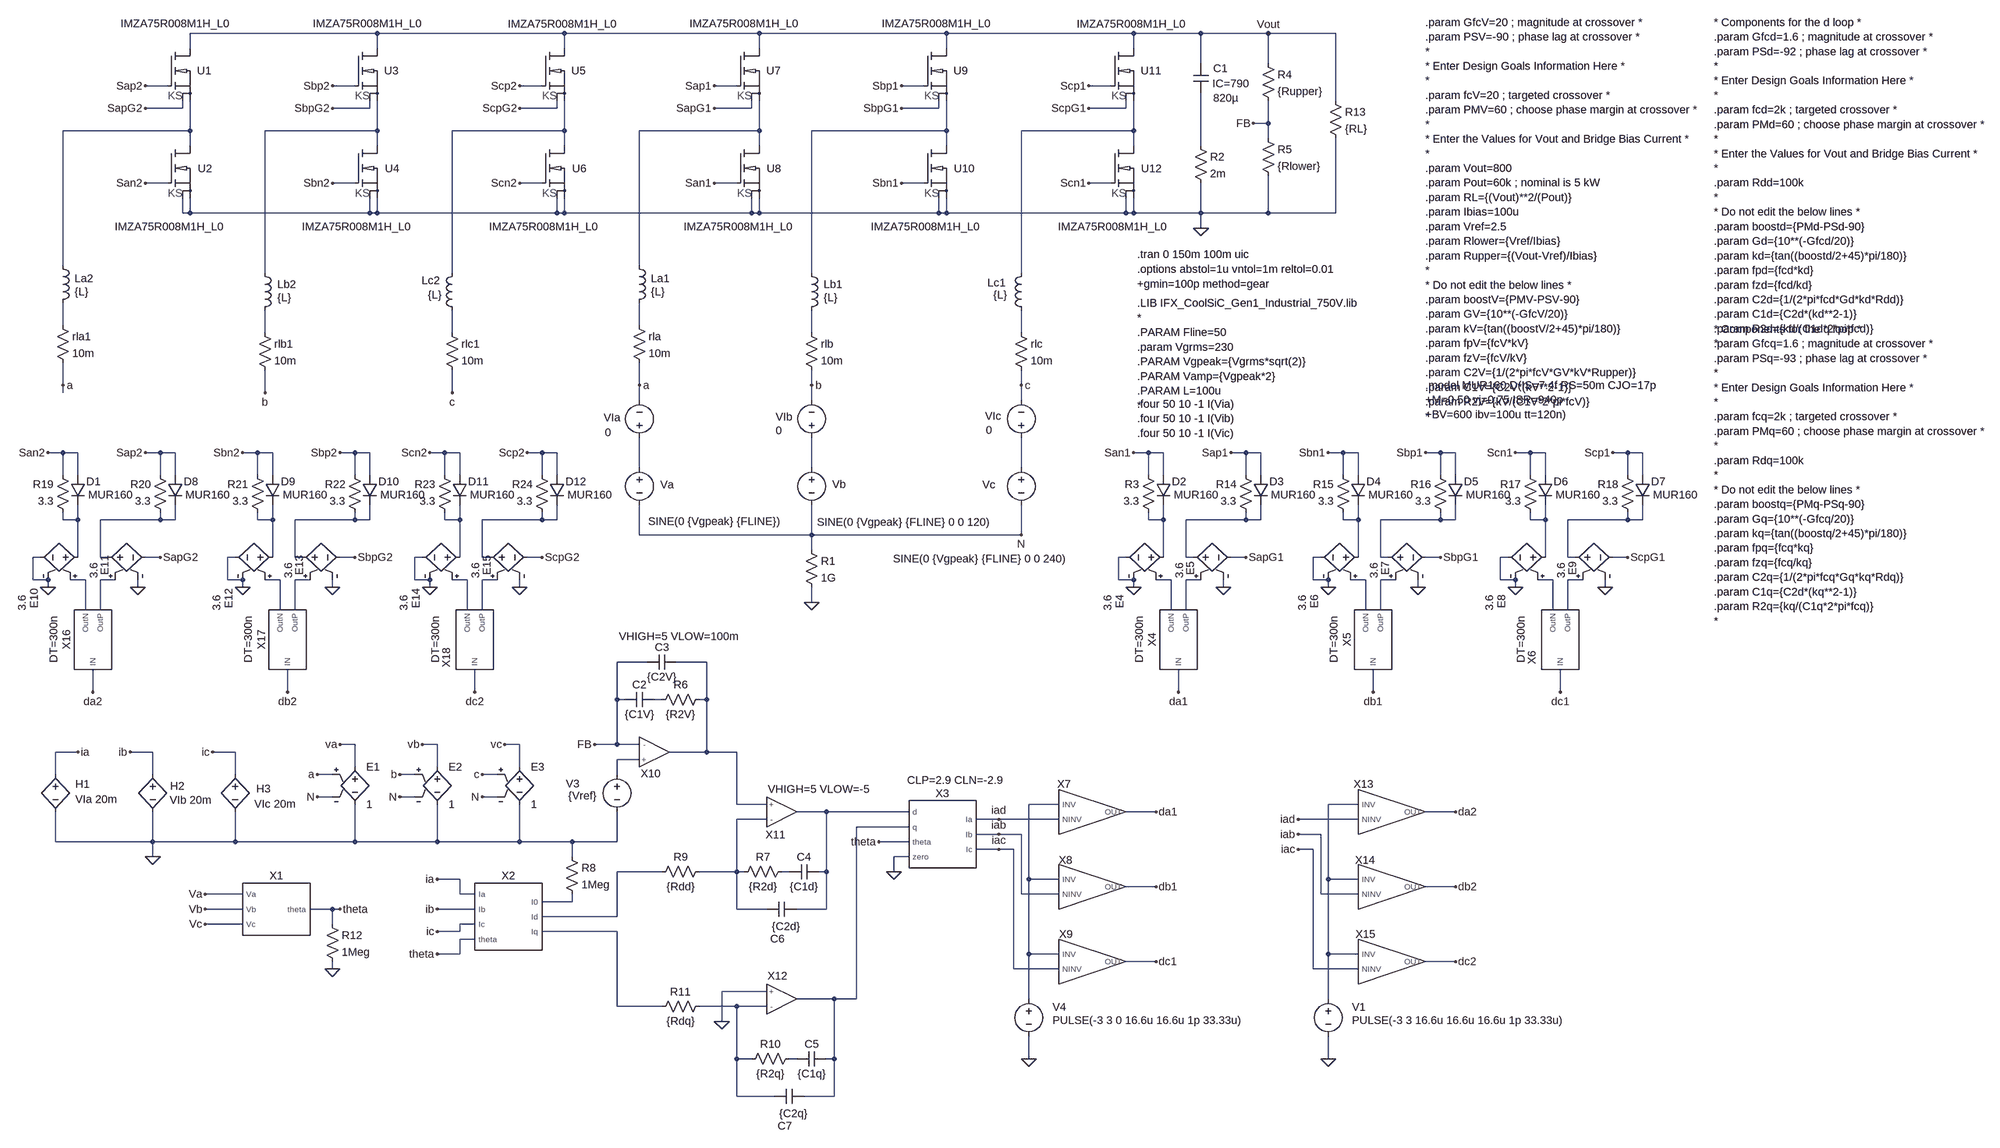
[diagram p0: schematic 3-phase PFC with SiC - interleaved.asc]
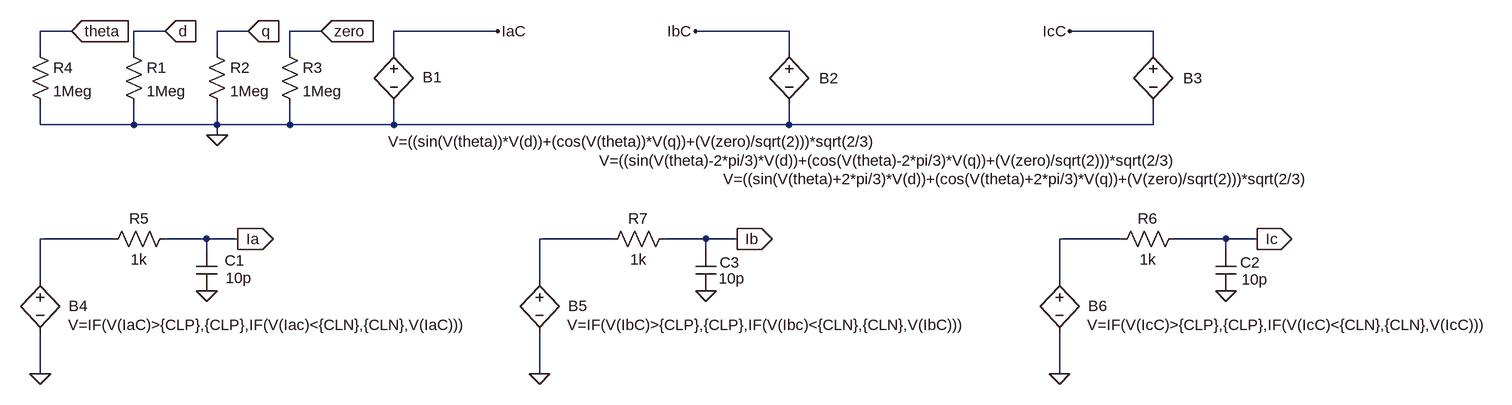
[diagram p1: sub-circuit inverse_dq0.asc]
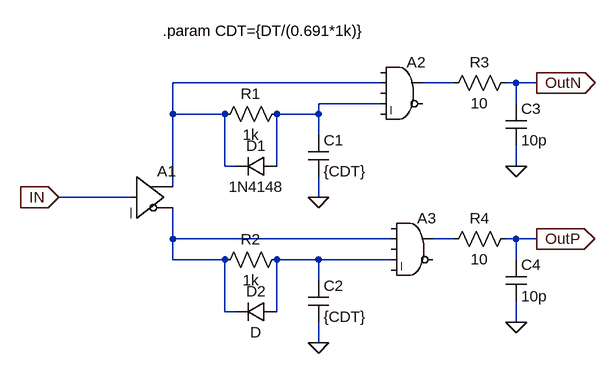
[diagram p2: sub-circuit dt_driver.asc]
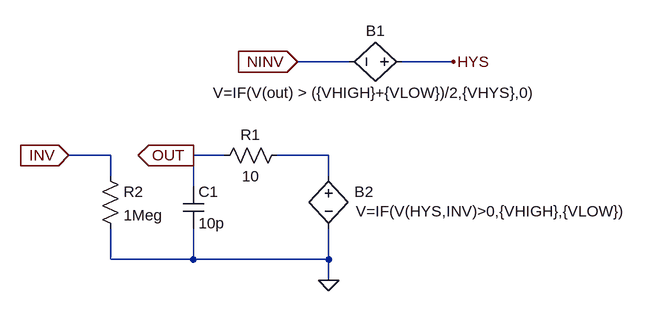
[diagram p3: sub-circuit comptof.asc]
3-phase PFC with SiC - interleaved.asc, the LTspice schematic file:
Version 4
SHEET 1 4316 1972
WIRE -528 -736 -928 -736
WIRE -128 -736 -528 -736
WIRE 288 -736 -128 -736
WIRE 688 -736 288 -736
WIRE 1088 -736 688 -736
WIRE 1232 -736 1088 -736
WIRE 1376 -736 1232 -736
WIRE 1520 -736 1376 -736
WIRE -928 -704 -928 -736
WIRE -528 -704 -528 -736
WIRE -128 -704 -128 -736
WIRE 288 -704 288 -736
WIRE 688 -704 688 -736
WIRE 1088 -704 1088 -736
WIRE 1232 -672 1232 -736
WIRE 1376 -672 1376 -736
WIRE -976 -624 -1024 -624
WIRE -576 -624 -624 -624
WIRE -176 -624 -224 -624
WIRE 240 -624 192 -624
WIRE 640 -624 592 -624
WIRE 1040 -624 992 -624
WIRE 1520 -592 1520 -736
WIRE -944 -576 -944 -592
WIRE -944 -576 -1024 -576
WIRE -544 -576 -544 -592
WIRE -544 -576 -624 -576
WIRE -144 -576 -144 -592
WIRE -144 -576 -224 -576
WIRE 272 -576 272 -592
WIRE 272 -576 192 -576
WIRE 672 -576 672 -592
WIRE 672 -576 592 -576
WIRE 1072 -576 1072 -592
WIRE 1072 -576 992 -576
WIRE 1376 -544 1376 -592
WIRE 1376 -544 1344 -544
WIRE -928 -528 -928 -592
WIRE -928 -528 -1200 -528
WIRE -528 -528 -528 -592
WIRE -528 -528 -768 -528
WIRE -128 -528 -128 -592
WIRE -128 -528 -368 -528
WIRE 288 -528 288 -592
WIRE 288 -528 32 -528
WIRE 688 -528 688 -592
WIRE 688 -528 400 -528
WIRE 1088 -528 1088 -592
WIRE 1088 -528 848 -528
WIRE 1376 -512 1376 -544
WIRE -928 -496 -928 -528
WIRE -528 -496 -528 -528
WIRE -128 -496 -128 -528
WIRE 288 -496 288 -528
WIRE 688 -496 688 -528
WIRE 1088 -496 1088 -528
WIRE 1232 -496 1232 -608
WIRE -976 -416 -1024 -416
WIRE -576 -416 -624 -416
WIRE -176 -416 -224 -416
WIRE 240 -416 192 -416
WIRE 640 -416 592 -416
WIRE 1040 -416 992 -416
WIRE -944 -352 -944 -384
WIRE -928 -352 -928 -384
WIRE -928 -352 -944 -352
WIRE -544 -352 -544 -384
WIRE -544 -352 -928 -352
WIRE -528 -352 -528 -384
WIRE -528 -352 -544 -352
WIRE -144 -352 -144 -384
WIRE -144 -352 -528 -352
WIRE -128 -352 -128 -384
WIRE -128 -352 -144 -352
WIRE 272 -352 272 -384
WIRE 272 -352 -128 -352
WIRE 288 -352 288 -384
WIRE 288 -352 272 -352
WIRE 672 -352 672 -384
WIRE 672 -352 288 -352
WIRE 688 -352 688 -384
WIRE 688 -352 672 -352
WIRE 1072 -352 1072 -384
WIRE 1072 -352 688 -352
WIRE 1088 -352 1088 -384
WIRE 1088 -352 1072 -352
WIRE 1232 -352 1232 -416
WIRE 1232 -352 1088 -352
WIRE 1376 -352 1376 -432
WIRE 1376 -352 1232 -352
WIRE 1520 -352 1520 -512
WIRE 1520 -352 1376 -352
WIRE 1232 -320 1232 -352
WIRE -1200 -240 -1200 -528
WIRE 32 -240 32 -528
WIRE -768 -224 -768 -528
WIRE -368 -224 -368 -528
WIRE 400 -224 400 -528
WIRE 848 -224 848 -528
WIRE -1200 -112 -1200 -160
WIRE 32 -112 32 -160
WIRE -768 -96 -768 -144
WIRE -368 -96 -368 -144
WIRE 400 -96 400 -144
WIRE 848 -96 848 -144
WIRE -1200 16 -1200 -32
WIRE 32 16 32 -32
WIRE 400 16 400 -16
WIRE 848 16 848 -16
WIRE -1200 32 -1200 16
WIRE -768 32 -768 -16
WIRE -368 32 -368 -16
WIRE 32 48 32 16
WIRE 400 48 400 16
WIRE 848 48 848 16
WIRE -1200 160 -1232 160
WIRE -1168 160 -1200 160
WIRE -992 160 -1024 160
WIRE -960 160 -992 160
WIRE -784 160 -816 160
WIRE -752 160 -784 160
WIRE -576 160 -608 160
WIRE -544 160 -576 160
WIRE -384 160 -416 160
WIRE -352 160 -384 160
WIRE -176 160 -208 160
WIRE -144 160 -176 160
WIRE 1120 160 1088 160
WIRE 1152 160 1120 160
WIRE 1328 160 1296 160
WIRE 1360 160 1328 160
WIRE 1536 160 1504 160
WIRE 1568 160 1536 160
WIRE 1744 160 1712 160
WIRE 1776 160 1744 160
WIRE 1936 160 1904 160
WIRE 1968 160 1936 160
WIRE 2144 160 2112 160
WIRE 2176 160 2144 160
WIRE 32 192 32 128
WIRE 400 192 400 128
WIRE 848 192 848 128
WIRE -1200 208 -1200 160
WIRE -1168 208 -1168 160
WIRE -992 208 -992 160
WIRE -960 208 -960 160
WIRE -784 208 -784 160
WIRE -752 208 -752 160
WIRE -576 208 -576 160
WIRE -544 208 -544 160
WIRE -384 208 -384 160
WIRE -352 208 -352 160
WIRE -176 208 -176 160
WIRE -144 208 -144 160
WIRE 1120 208 1120 160
WIRE 1152 208 1152 160
WIRE 1328 208 1328 160
WIRE 1360 208 1360 160
WIRE 1536 208 1536 160
WIRE 1568 208 1568 160
WIRE 1744 208 1744 160
WIRE 1776 208 1776 160
WIRE 1936 208 1936 160
WIRE 1968 208 1968 160
WIRE 2144 208 2144 160
WIRE 2176 208 2176 160
WIRE -1200 304 -1200 288
WIRE -1168 304 -1168 272
WIRE -1168 304 -1200 304
WIRE -992 304 -992 288
WIRE -992 304 -1120 304
WIRE -960 304 -960 272
WIRE -960 304 -992 304
WIRE -784 304 -784 288
WIRE -752 304 -752 272
WIRE -752 304 -784 304
WIRE -576 304 -576 288
WIRE -576 304 -704 304
WIRE -544 304 -544 272
WIRE -544 304 -576 304
WIRE -384 304 -384 288
WIRE -352 304 -352 272
WIRE -352 304 -384 304
WIRE -176 304 -176 288
WIRE -176 304 -304 304
WIRE -144 304 -144 272
WIRE -144 304 -176 304
WIRE 1120 304 1120 288
WIRE 1152 304 1152 272
WIRE 1152 304 1120 304
WIRE 1328 304 1328 288
WIRE 1328 304 1200 304
WIRE 1360 304 1360 272
WIRE 1360 304 1328 304
WIRE 1536 304 1536 288
WIRE 1568 304 1568 272
WIRE 1568 304 1536 304
WIRE 1744 304 1744 288
WIRE 1744 304 1616 304
WIRE 1776 304 1776 272
WIRE 1776 304 1744 304
WIRE 1936 304 1936 288
WIRE 1968 304 1968 272
WIRE 1968 304 1936 304
WIRE 2144 304 2144 288
WIRE 2144 304 2016 304
WIRE 2176 304 2176 272
WIRE 2176 304 2144 304
WIRE 32 336 32 272
WIRE 400 336 400 272
WIRE 400 336 32 336
WIRE 848 336 848 272
WIRE 848 336 400 336
WIRE 400 368 400 336
WIRE -1248 384 -1264 384
WIRE -1168 384 -1168 304
WIRE -1120 384 -1120 304
WIRE -1104 384 -1120 384
WIRE -992 384 -1024 384
WIRE -832 384 -848 384
WIRE -752 384 -752 304
WIRE -704 384 -704 304
WIRE -688 384 -704 384
WIRE -576 384 -608 384
WIRE -432 384 -448 384
WIRE -352 384 -352 304
WIRE -304 384 -304 304
WIRE -288 384 -304 384
WIRE -176 384 -208 384
WIRE 1072 384 1056 384
WIRE 1152 384 1152 304
WIRE 1200 384 1200 304
WIRE 1216 384 1200 384
WIRE 1328 384 1296 384
WIRE 1488 384 1472 384
WIRE 1568 384 1568 304
WIRE 1616 384 1616 304
WIRE 1632 384 1616 384
WIRE 1744 384 1712 384
WIRE 1888 384 1872 384
WIRE 1968 384 1968 304
WIRE 2016 384 2016 304
WIRE 2032 384 2016 384
WIRE 2144 384 2112 384
WIRE -1264 432 -1264 384
WIRE -1232 432 -1264 432
WIRE -1152 432 -1184 432
WIRE -1088 432 -1120 432
WIRE -848 432 -848 384
WIRE -816 432 -848 432
WIRE -736 432 -768 432
WIRE -672 432 -704 432
WIRE -448 432 -448 384
WIRE -416 432 -448 432
WIRE -336 432 -368 432
WIRE -272 432 -304 432
WIRE 1056 432 1056 384
WIRE 1088 432 1056 432
WIRE 1168 432 1136 432
WIRE 1232 432 1200 432
WIRE 1472 432 1472 384
WIRE 1504 432 1472 432
WIRE 1584 432 1552 432
WIRE 1648 432 1616 432
WIRE 1872 432 1872 384
WIRE 1904 432 1872 432
WIRE 1984 432 1952 432
WIRE 2048 432 2016 432
WIRE -1232 448 -1232 432
WIRE -1040 448 -1040 432
WIRE -816 448 -816 432
WIRE -624 448 -624 432
WIRE -416 448 -416 432
WIRE -224 448 -224 432
WIRE 1088 448 1088 432
WIRE 1280 448 1280 432
WIRE 1504 448 1504 432
WIRE 1696 448 1696 432
WIRE 1904 448 1904 432
WIRE 2096 448 2096 432
WIRE 400 480 400 448
WIRE -1152 496 -1152 432
WIRE -1120 496 -1120 432
WIRE -736 496 -736 432
WIRE -704 496 -704 432
WIRE -336 496 -336 432
WIRE -304 496 -304 432
WIRE 1168 496 1168 432
WIRE 1200 496 1200 432
WIRE 1584 496 1584 432
WIRE 1616 496 1616 432
WIRE 1984 496 1984 432
WIRE 2016 496 2016 432
WIRE 48 608 -16 608
WIRE 176 608 112 608
WIRE -1136 672 -1136 624
WIRE -720 672 -720 624
WIRE -320 672 -320 624
WIRE 1184 672 1184 624
WIRE 1600 672 1600 624
WIRE 2000 672 2000 624
WIRE -16 688 -16 608
WIRE 0 688 -16 688
WIRE 80 688 64 688
WIRE 176 688 176 608
WIRE 176 688 160 688
WIRE -576 784 -608 784
WIRE -400 784 -432 784
WIRE -224 784 -256 784
WIRE -16 784 -16 688
WIRE -16 784 -64 784
WIRE 32 784 -16 784
WIRE -1168 800 -1216 800
WIRE -1008 800 -1056 800
WIRE -832 800 -880 800
WIRE 176 800 176 688
WIRE 176 800 96 800
WIRE 240 800 176 800
WIRE 32 816 -16 816
WIRE -576 832 -576 784
WIRE -400 832 -400 784
WIRE -224 832 -224 784
WIRE -1216 848 -1216 800
WIRE -1008 848 -1008 800
WIRE -832 848 -832 800
WIRE -624 848 -656 848
WIRE -448 848 -480 848
WIRE -272 848 -304 848
WIRE -16 848 -16 816
WIRE -624 896 -656 896
WIRE -448 896 -480 896
WIRE -272 896 -304 896
WIRE 240 912 240 800
WIRE 304 912 240 912
WIRE 928 912 864 912
WIRE 1568 912 1504 912
WIRE 432 928 368 928
WIRE 608 928 432 928
WIRE 1136 928 1072 928
WIRE 1776 928 1712 928
WIRE 304 944 240 944
WIRE 800 944 752 944
WIRE 928 944 800 944
WIRE 1568 944 1440 944
WIRE 608 960 496 960
WIRE 800 976 752 976
WIRE 848 976 800 976
WIRE 1488 976 1440 976
WIRE -1216 992 -1216 928
WIRE -1008 992 -1008 928
WIRE -1008 992 -1216 992
WIRE -832 992 -832 928
WIRE -832 992 -1008 992
WIRE -576 992 -576 912
WIRE -576 992 -832 992
WIRE -400 992 -400 912
WIRE -400 992 -576 992
WIRE -224 992 -224 912
WIRE -224 992 -400 992
WIRE -112 992 -224 992
WIRE -16 992 -16 928
WIRE -16 992 -112 992
WIRE 608 992 544 992
WIRE 800 1008 752 1008
WIRE 832 1008 800 1008
WIRE 1472 1008 1440 1008
WIRE -1008 1024 -1008 992
WIRE -112 1024 -112 992
WIRE 608 1024 576 1024
WIRE 80 1056 -16 1056
WIRE 240 1056 240 944
WIRE 240 1056 160 1056
WIRE 256 1056 240 1056
WIRE 352 1056 336 1056
WIRE 432 1056 432 928
WIRE 432 1056 416 1056
WIRE 576 1056 576 1024
WIRE -352 1072 -400 1072
WIRE 864 1072 864 912
WIRE 928 1072 864 1072
WIRE 1504 1072 1504 912
WIRE 1568 1072 1504 1072
WIRE 1136 1088 1072 1088
WIRE 1776 1088 1712 1088
WIRE -816 1104 -896 1104
WIRE -352 1104 -352 1072
WIRE -320 1104 -352 1104
WIRE 848 1104 848 976
WIRE 928 1104 848 1104
WIRE 1488 1104 1488 976
WIRE 1568 1104 1488 1104
WIRE -112 1120 -112 1104
WIRE -112 1120 -176 1120
WIRE -816 1136 -896 1136
WIRE -624 1136 -672 1136
WIRE -608 1136 -624 1136
WIRE -320 1136 -400 1136
WIRE 240 1136 240 1056
WIRE 304 1136 240 1136
WIRE 432 1136 432 1056
WIRE 432 1136 368 1136
WIRE -16 1152 -16 1056
WIRE -16 1152 -176 1152
WIRE -816 1168 -896 1168
WIRE -624 1168 -624 1136
WIRE -320 1168 -352 1168
WIRE -352 1184 -352 1168
WIRE -352 1184 -400 1184
WIRE -16 1184 -176 1184
WIRE -320 1200 -352 1200
WIRE -352 1232 -352 1200
WIRE -352 1232 -400 1232
WIRE 864 1232 864 1072
WIRE 928 1232 864 1232
WIRE 1504 1232 1504 1072
WIRE 1568 1232 1504 1232
WIRE 1136 1248 1072 1248
WIRE 1776 1248 1712 1248
WIRE -624 1264 -624 1248
WIRE 832 1264 832 1008
WIRE 928 1264 832 1264
WIRE 1472 1264 1472 1008
WIRE 1568 1264 1472 1264
WIRE 304 1312 208 1312
WIRE 448 1328 368 1328
WIRE 496 1328 496 960
WIRE 496 1328 448 1328
WIRE 864 1328 864 1232
WIRE 1504 1328 1504 1232
WIRE -16 1344 -16 1184
WIRE 80 1344 -16 1344
WIRE 240 1344 160 1344
WIRE 304 1344 240 1344
WIRE 208 1376 208 1312
WIRE 240 1456 240 1344
WIRE 272 1456 240 1456
WIRE 368 1456 352 1456
WIRE 448 1456 448 1328
WIRE 448 1456 432 1456
WIRE 864 1456 864 1408
WIRE 1504 1456 1504 1408
WIRE 240 1536 240 1456
WIRE 320 1536 240 1536
WIRE 448 1536 448 1456
WIRE 448 1536 384 1536
FLAG 400 480 0
FLAG -1168 800 ia
FLAG -1056 800 ib
FLAG -880 800 ic
FLAG 32 16 a
FLAG 400 16 b
FLAG 848 16 c
FLAG -1008 1024 0
FLAG 192 -624 Sap1
FLAG 192 -416 San1
FLAG 1344 -544 FB
FLAG 1376 -736 Vout
FLAG -608 784 va
FLAG 848 336 N
FLAG -656 896 N
FLAG -656 848 a
FLAG -432 784 vb
FLAG -480 896 N
FLAG -480 848 b
FLAG -256 784 vc
FLAG -304 896 N
FLAG -304 848 c
FLAG -608 1136 theta
FLAG -896 1104 Va
FLAG -896 1136 Vb
FLAG -896 1168 Vc
FLAG -400 1072 ia
FLAG -400 1136 ib
FLAG -400 1184 ic
FLAG -400 1232 theta
FLAG -64 784 FB
FLAG 208 1376 0
FLAG 544 992 theta
FLAG 576 1056 0
FLAG 864 1456 0
FLAG 1136 928 da1
FLAG 1136 1088 db1
FLAG 1136 1248 dc1
FLAG 1184 672 da1
FLAG 1088 160 San1
FLAG 1296 160 Sap1
FLAG 1600 672 db1
FLAG 2000 672 dc1
FLAG -624 1264 0
FLAG 1088 448 0
FLAG 1280 448 0
FLAG 1328 384 SapG1
FLAG 1232 -320 0
FLAG 1504 160 Sbn1
FLAG 1712 160 Sbp1
FLAG 1504 448 0
FLAG 1696 448 0
FLAG 1744 384 SbpG1
FLAG 1904 160 Scn1
FLAG 2112 160 Scp1
FLAG 1904 448 0
FLAG 2096 448 0
FLAG 2144 384 ScpG1
FLAG 192 -576 SapG1
FLAG 592 -624 Sbp1
FLAG 592 -416 Sbn1
FLAG 592 -576 SbpG1
FLAG 992 -624 Scp1
FLAG 992 -416 Scn1
FLAG 992 -576 ScpG1
FLAG 800 944 iad
FLAG 800 976 iab
FLAG 800 1008 iac
FLAG 1504 1456 0
FLAG 1776 928 da2
FLAG 1776 1088 db2
FLAG 1776 1248 dc2
FLAG 1440 944 iad
FLAG 1440 976 iab
FLAG 1440 1008 iac
FLAG -1024 -624 Sap2
FLAG -1024 -416 San2
FLAG -1024 -576 SapG2
FLAG -624 -624 Sbp2
FLAG -624 -416 Sbn2
FLAG -624 -576 SbpG2
FLAG -224 -624 Scp2
FLAG -224 -416 Scn2
FLAG -224 -576 ScpG2
FLAG -1200 16 a
FLAG -768 32 b
FLAG -368 32 c
FLAG -1136 672 da2
FLAG -1232 160 San2
FLAG -1024 160 Sap2
FLAG -720 672 db2
FLAG -320 672 dc2
FLAG -1232 448 0
FLAG -1040 448 0
FLAG -992 384 SapG2
FLAG -816 160 Sbn2
FLAG -608 160 Sbp2
FLAG -816 448 0
FLAG -624 448 0
FLAG -576 384 SbpG2
FLAG -416 160 Scn2
FLAG -208 160 Scp2
FLAG -416 448 0
FLAG -224 448 0
FLAG -176 384 ScpG2
SYMBOL voltage 32 176 R0
WINDOW 0 45 53 Left 2
WINDOW 3 19 131 Left 2
WINDOW 123 0 0 Left 0
WINDOW 39 0 0 Left 0
SYMATTR InstName Va
SYMATTR Value SINE(0 {Vgpeak} {FLINE})
SYMBOL voltage 400 176 R0
WINDOW 0 44 52 Left 2
WINDOW 3 12 133 Left 2
WINDOW 123 0 0 Left 0
WINDOW 39 0 0 Left 0
SYMATTR InstName Vb
SYMATTR Value SINE(0 {Vgpeak} {FLINE} 0 0 120)
SYMBOL voltage 848 176 R0
WINDOW 0 -83 53 Left 2
WINDOW 3 -274 211 Left 2
WINDOW 123 0 0 Left 0
WINDOW 39 0 0 Left 0
SYMATTR InstName Vc
SYMATTR Value SINE(0 {Vgpeak} {FLINE} 0 0 240)
SYMBOL res 384 352 R0
SYMATTR InstName R1
SYMATTR Value 1G
SYMBOL res 16 -128 R0
SYMATTR InstName rla
SYMATTR Value 10m
SYMBOL res 384 -112 R0
SYMATTR InstName rlb
SYMATTR Value 10m
SYMBOL res 832 -112 R0
SYMATTR InstName rlc
SYMATTR Value 10m
SYMBOL h -1216 832 R0
WINDOW 0 43 37 Left 2
WINDOW 3 43 69 Left 2
SYMATTR InstName H1
SYMATTR Value VIa 20m
SYMBOL h -1008 832 R0
WINDOW 0 37 41 Left 2
WINDOW 3 36 71 Left 2
SYMATTR InstName H2
SYMATTR Value VIb 20m
SYMBOL h -832 832 R0
WINDOW 0 45 47 Left 2
WINDOW 3 41 79 Left 2
SYMATTR InstName H3
SYMATTR Value VIc 20m
SYMBOL ind 16 -256 R0
WINDOW 0 41 44 Left 2
WINDOW 3 41 72 Left 2
SYMATTR InstName La1
SYMATTR Value {L}
SYMBOL ind 384 -240 R0
WINDOW 0 42 40 Left 2
WINDOW 3 42 69 Left 2
SYMATTR InstName Lb1
SYMATTR Value {L}
SYMBOL ind 864 -128 R180
WINDOW 0 49 75 Left 2
WINDOW 3 46 49 Left 2
SYMATTR InstName Lc1
SYMATTR Value {L}
SYMBOL voltage 32 144 R180
WINDOW 0 40 59 Left 2
WINDOW 3 60 27 Left 2
WINDOW 123 0 0 Left 0
WINDOW 39 0 0 Left 0
SYMATTR InstName VIa
SYMATTR Value 0
SYMBOL voltage 400 144 R180
WINDOW 0 41 60 Left 2
WINDOW 3 63 31 Left 2
WINDOW 123 0 0 Left 0
WINDOW 39 0 0 Left 0
SYMATTR InstName VIb
SYMATTR Value 0
SYMBOL voltage 848 144 R180
WINDOW 0 43 62 Left 2
WINDOW 3 62 32 Left 2
WINDOW 123 0 0 Left 0
WINDOW 39 0 0 Left 0
SYMATTR InstName VIc
SYMATTR Value 0
SYMBOL cap 1216 -672 R0
WINDOW 0 42 11 Left 2
WINDOW 3 42 74 Left 2
WINDOW 123 41 43 Left 2
SYMATTR InstName C1
SYMATTR Value 820µ
SYMATTR Value2 IC=790
SYMBOL res 1216 -512 R0
SYMATTR InstName R2
SYMATTR Value 2m
SYMBOL res 1360 -688 R0
SYMATTR InstName R4
SYMATTR Value {Rupper}
SYMBOL res 1360 -528 R0
SYMATTR InstName R5
SYMATTR Value {Rlower}
SYMBOL e -576 816 R0
SYMATTR InstName E1
SYMATTR Value 1
SYMBOL e -400 816 R0
SYMATTR InstName E2
SYMATTR Value 1
SYMBOL e -224 816 R0
SYMATTR InstName E3
SYMATTR Value 1
SYMBOL theta_sub -752 1136 R0
SYMATTR InstName X1
SYMBOL dq0_sub -256 1152 R0
SYMATTR InstName X2
SYMBOL res 176 672 R90
WINDOW 0 0 56 VBottom 2
WINDOW 3 32 56 VTop 2
SYMATTR InstName R6
SYMATTR Value {R2V}
SYMBOL cap 64 672 R90
WINDOW 0 0 32 VBottom 2
WINDOW 3 32 32 VTop 2
SYMATTR InstName C2
SYMATTR Value {C1V}
SYMBOL cap 112 592 R90
WINDOW 0 0 32 VBottom 2
WINDOW 3 32 32 VTop 2
SYMATTR InstName C3
SYMATTR Value {C2V}
SYMBOL voltage -16 832 M0
WINDOW 0 80 36 Left 2
WINDOW 3 43 62 Left 2
SYMATTR InstName V3
SYMATTR Value {Vref}
SYMBOL res 240 1072 R270
WINDOW 0 32 56 VTop 2
WINDOW 3 0 56 VBottom 2
SYMATTR InstName R7
SYMATTR Value {R2d}
SYMBOL cap 352 1072 R270
WINDOW 0 32 32 VTop 2
WINDOW 3 0 32 VBottom 2
SYMATTR InstName C4
SYMATTR Value {C1d}
SYMBOL cap 304 1152 R270
WINDOW 0 -63 23 VTop 2
WINDOW 3 -5 41 VBottom 2
SYMATTR InstName C6
SYMATTR Value {C2d}
SYMBOL res -128 1008 R0
SYMATTR InstName R8
SYMATTR Value 1Meg
SYMBOL res 176 1040 R90
WINDOW 0 0 56 VBottom 2
WINDOW 3 32 56 VTop 2
SYMATTR InstName R9
SYMATTR Value {Rdd}
SYMBOL res 256 1472 R270
WINDOW 0 32 56 VTop 2
WINDOW 3 0 56 VBottom 2
SYMATTR InstName R10
SYMATTR Value {R2q}
SYMBOL cap 368 1472 R270
WINDOW 0 32 32 VTop 2
WINDOW 3 0 32 VBottom 2
SYMATTR InstName C5
SYMATTR Value {C1q}
SYMBOL cap 320 1552 R270
WINDOW 0 -63 23 VTop 2
WINDOW 3 -5 41 VBottom 2
SYMATTR InstName C7
SYMATTR Value {C2q}
SYMBOL res 176 1328 R90
WINDOW 0 0 56 VBottom 2
WINDOW 3 32 56 VTop 2
SYMATTR InstName R11
SYMATTR Value {Rdq}
SYMBOL Inverse_dq0 672 976 R0
WINDOW 39 35 -100 Bottom 2
SYMATTR SpiceLine CLP=2.9 CLN=-2.9
SYMATTR InstName X3
SYMBOL voltage 864 1312 R0
WINDOW 123 0 0 Left 0
WINDOW 39 0 0 Left 0
WINDOW 0 51 33 Left 2
WINDOW 3 51 62 Left 2
SYMATTR InstName V4
SYMATTR Value PULSE(-3 3 0 16.6u 16.6u 1p 33.33u)
SYMBOL DT_driver 1184 560 R270
WINDOW 39 0 -68 Bottom 2
SYMATTR SpiceLine DT=300n
SYMATTR InstName X4
SYMBOL DT_driver 1600 560 R270
WINDOW 39 0 -68 Bottom 2
SYMATTR SpiceLine DT=300n
SYMATTR InstName X5
SYMBOL DT_driver 2000 560 R270
WINDOW 39 0 -68 Bottom 2
WINDOW 0 -38 -45 Bottom 2
SYMATTR SpiceLine DT=300n
SYMATTR InstName X6
SYMBOL res -640 1152 R0
SYMATTR InstName R12
SYMATTR Value 1Meg
SYMBOL COMPTOF 992 928 R0
WINDOW 0 -52 -44 Bottom 2
SYMATTR InstName X7
SYMATTR SpiceLine VHIGH=5 VLOW=100m VHYS=10m
SYMBOL COMPTOF 992 1088 R0
WINDOW 0 -49 -41 Bottom 2
SYMATTR InstName X8
SYMATTR SpiceLine VHIGH=5 VLOW=100m VHYS=10m
SYMBOL COMPTOF 992 1248 R0
WINDOW 0 -48 -43 Bottom 2
SYMATTR InstName X9
SYMATTR SpiceLine VHIGH=5 VLOW=100m VHYS=10m
SYMBOL opampTOF 96 784 R0
WINDOW 0 -40 78 Bottom 2
WINDOW 39 20 -216 Bottom 2
SYMATTR InstName X10
SYMATTR SpiceLine VHIGH=5 VLOW=100m
SYMBOL opampTOF 368 944 M180
WINDOW 0 -45 -17 Bottom 2
WINDOW 39 47 80 Bottom 2
SYMATTR InstName X11
SYMATTR SpiceLine VHIGH=5 VLOW=-5
SYMBOL opampTOF 368 1344 M180
WINDOW 0 -41 81 Bottom 2
SYMATTR InstName X12
SYMATTR SpiceLine VHIGH=5 VLOW=-5
SYMBOL res 1504 -608 R0
SYMATTR InstName R13
SYMATTR Value {RL}
SYMBOL e 1168 384 M270
WINDOW 0 -109 109 Left 2
WINDOW 3 -114 135 Left 2
SYMATTR InstName E4
SYMATTR Value 3.6
SYMBOL e 1200 384 R270
WINDOW 0 -38 10 Left 2
WINDOW 3 -45 -14 Left 2
SYMATTR InstName E5
SYMATTR Value 3.6
SYMBOL res 1136 304 R180
WINDOW 0 36 76 Left 2
WINDOW 3 36 40 Left 2
SYMATTR InstName R3
SYMATTR Value 3.3
SYMBOL res 1344 304 R180
WINDOW 0 36 76 Left 2
WINDOW 3 36 40 Left 2
SYMATTR InstName R14
SYMATTR Value 3.3
SYMBOL e 1584 384 M270
WINDOW 0 -109 109 Left 2
WINDOW 3 -114 135 Left 2
SYMATTR InstName E6
SYMATTR Value 3.6
SYMBOL e 1616 384 R270
WINDOW 0 -38 10 Left 2
WINDOW 3 -45 -14 Left 2
SYMATTR InstName E7
SYMATTR Value 3.6
SYMBOL res 1552 304 R180
WINDOW 0 36 76 Left 2
WINDOW 3 36 40 Left 2
SYMATTR InstName R15
SYMATTR Value 3.3
SYMBOL res 1760 304 R180
WINDOW 0 36 76 Left 2
WINDOW 3 36 40 Left 2
SYMATTR InstName R16
SYMATTR Value 3.3
SYMBOL e 1984 384 M270
WINDOW 0 -109 109 Left 2
WINDOW 3 -114 135 Left 2
SYMATTR InstName E8
SYMATTR Value 3.6
SYMBOL e 2016 384 R270
WINDOW 0 -38 10 Left 2
WINDOW 3 -45 -14 Left 2
SYMATTR InstName E9
SYMATTR Value 3.6
SYMBOL res 1952 304 R180
WINDOW 0 36 76 Left 2
WINDOW 3 36 40 Left 2
SYMATTR InstName R17
SYMATTR Value 3.3
SYMBOL res 2160 304 R180
WINDOW 0 36 76 Left 2
WINDOW 3 36 40 Left 2
SYMATTR InstName R18
SYMATTR Value 3.3
SYMBOL TO247_4L 240 -704 R0
WINDOW 3 -101 -53 Left 2
WINDOW 0 63 48 Left 2
SYMATTR Value IMZA75R008M1H_L0
SYMATTR InstName U7
SYMBOL TO247_4L 240 -496 R0
WINDOW 3 -113 173 Left 2
WINDOW 0 64 49 Left 2
SYMATTR Value IMZA75R008M1H_L0
SYMATTR InstName U8
SYMBOL TO247_4L 640 -704 R0
WINDOW 3 -90 -53 Left 2
WINDOW 0 63 48 Left 2
SYMATTR Value IMZA75R008M1H_L0
SYMATTR InstName U9
SYMBOL TO247_4L 640 -496 R0
WINDOW 3 -113 173 Left 2
WINDOW 0 64 49 Left 2
SYMATTR Value IMZA75R008M1H_L0
SYMATTR InstName U10
SYMBOL TO247_4L 1040 -704 R0
WINDOW 3 -73 -52 Left 2
WINDOW 0 63 48 Left 2
SYMATTR Value IMZA75R008M1H_L0
SYMATTR InstName U11
SYMBOL TO247_4L 1040 -496 R0
WINDOW 3 -113 173 Left 2
WINDOW 0 64 49 Left 2
SYMATTR Value IMZA75R008M1H_L0
SYMATTR InstName U12
SYMBOL diode 1136 208 R0
WINDOW 0 34 14 Left 2
WINDOW 3 38 42 Left 2
SYMATTR InstName D2
SYMATTR Value MUR160
SYMBOL diode 1344 208 R0
WINDOW 0 34 14 Left 2
WINDOW 3 38 42 Left 2
SYMATTR InstName D3
SYMATTR Value MUR160
SYMBOL diode 1552 208 R0
WINDOW 0 34 14 Left 2
WINDOW 3 38 42 Left 2
SYMATTR InstName D4
SYMATTR Value MUR160
SYMBOL diode 1760 208 R0
WINDOW 0 34 14 Left 2
WINDOW 3 38 42 Left 2
SYMATTR InstName D5
SYMATTR Value MUR160
SYMBOL diode 1952 208 R0
WINDOW 0 34 14 Left 2
WINDOW 3 38 42 Left 2
SYMATTR InstName D6
SYMATTR Value MUR160
SYMBOL diode 2160 208 R0
WINDOW 0 34 14 Left 2
WINDOW 3 38 42 Left 2
SYMATTR InstName D7
SYMATTR Value MUR160
SYMBOL voltage 1504 1312 R0
WINDOW 123 0 0 Left 0
WINDOW 39 0 0 Left 0
WINDOW 0 51 33 Left 2
WINDOW 3 51 62 Left 2
SYMATTR InstName V1
SYMATTR Value PULSE(-3 3 16.6u 16.6u 16.6u 1p 33.33u)
SYMBOL COMPTOF 1632 928 R0
WINDOW 0 -52 -44 Bottom 2
SYMATTR InstName X13
SYMATTR SpiceLine VHIGH=5 VLOW=100m VHYS=10m
SYMBOL COMPTOF 1632 1088 R0
WINDOW 0 -49 -41 Bottom 2
SYMATTR InstName X14
SYMATTR SpiceLine VHIGH=5 VLOW=100m VHYS=10m
SYMBOL COMPTOF 1632 1248 R0
WINDOW 0 -48 -43 Bottom 2
SYMATTR InstName X15
SYMATTR SpiceLine VHIGH=5 VLOW=100m VHYS=10m
SYMBOL TO247_4L -976 -704 R0
WINDOW 3 -101 -53 Left 2
WINDOW 0 63 48 Left 2
SYMATTR Value IMZA75R008M1H_L0
SYMATTR InstName U1
SYMBOL TO247_4L -976 -496 R0
WINDOW 3 -113 173 Left 2
WINDOW 0 64 49 Left 2
SYMATTR Value IMZA75R008M1H_L0
SYMATTR InstName U2
SYMBOL TO247_4L -576 -704 R0
WINDOW 3 -90 -53 Left 2
WINDOW 0 63 48 Left 2
SYMATTR Value IMZA75R008M1H_L0
SYMATTR InstName U3
SYMBOL TO247_4L -576 -496 R0
WINDOW 3 -113 173 Left 2
WINDOW 0 64 49 Left 2
SYMATTR Value IMZA75R008M1H_L0
SYMATTR InstName U4
SYMBOL TO247_4L -176 -704 R0
WINDOW 3 -73 -52 Left 2
WINDOW 0 63 48 Left 2
SYMATTR Value IMZA75R008M1H_L0
SYMATTR InstName U5
SYMBOL TO247_4L -176 -496 R0
WINDOW 3 -113 173 Left 2
WINDOW 0 64 49 Left 2
SYMATTR Value IMZA75R008M1H_L0
SYMATTR InstName U6
SYMBOL res -1216 -128 R0
SYMATTR InstName rla1
SYMATTR Value 10m
SYMBOL res -784 -112 R0
SYMATTR InstName rlb1
SYMATTR Value 10m
SYMBOL res -384 -112 R0
SYMATTR InstName rlc1
SYMATTR Value 10m
SYMBOL ind -1216 -256 R0
WINDOW 0 41 44 Left 2
WINDOW 3 41 72 Left 2
SYMATTR InstName La2
SYMATTR Value {L}
SYMBOL ind -784 -240 R0
WINDOW 0 42 40 Left 2
WINDOW 3 42 69 Left 2
SYMATTR InstName Lb2
SYMATTR Value {L}
SYMBOL ind -352 -128 R180
WINDOW 0 42 80 Left 2
WINDOW 3 38 49 Left 2
SYMATTR InstName Lc2
SYMATTR Value {L}
SYMBOL DT_driver -1136 560 R270
WINDOW 39 0 -68 Bottom 2
SYMATTR SpiceLine DT=300n
SYMATTR InstName X16
SYMBOL DT_driver -720 560 R270
WINDOW 39 0 -68 Bottom 2
SYMATTR SpiceLine DT=300n
SYMATTR InstName X17
SYMBOL DT_driver -320 560 R270
WINDOW 39 0 -68 Bottom 2
WINDOW 0 -38 -45 Bottom 2
SYMATTR SpiceLine DT=300n
SYMATTR InstName X18
SYMBOL e -1152 384 M270
WINDOW 0 -109 109 Left 2
WINDOW 3 -114 135 Left 2
SYMATTR InstName E10
SYMATTR Value 3.6
SYMBOL e -1120 384 R270
WINDOW 0 -38 10 Left 2
WINDOW 3 -45 -14 Left 2
SYMATTR InstName E11
SYMATTR Value 3.6
SYMBOL res -1184 304 R180
WINDOW 0 36 76 Left 2
WINDOW 3 36 40 Left 2
SYMATTR InstName R19
SYMATTR Value 3.3
SYMBOL res -976 304 R180
WINDOW 0 36 76 Left 2
WINDOW 3 36 40 Left 2
SYMATTR InstName R20
SYMATTR Value 3.3
SYMBOL e -736 384 M270
WINDOW 0 -109 109 Left 2
WINDOW 3 -114 135 Left 2
SYMATTR InstName E12
SYMATTR Value 3.6
SYMBOL e -704 384 R270
WINDOW 0 -38 10 Left 2
WINDOW 3 -45 -14 Left 2
SYMATTR InstName E13
SYMATTR Value 3.6
SYMBOL res -768 304 R180
WINDOW 0 36 76 Left 2
WINDOW 3 36 40 Left 2
SYMATTR InstName R21
SYMATTR Value 3.3
SYMBOL res -560 304 R180
WINDOW 0 36 76 Left 2
WINDOW 3 36 40 Left 2
SYMATTR InstName R22
SYMATTR Value 3.3
SYMBOL e -336 384 M270
WINDOW 0 -109 109 Left 2
WINDOW 3 -114 135 Left 2
SYMATTR InstName E14
SYMATTR Value 3.6
SYMBOL e -304 384 R270
WINDOW 0 -38 10 Left 2
WINDOW 3 -45 -14 Left 2
SYMATTR InstName E15
SYMATTR Value 3.6
SYMBOL res -368 304 R180
WINDOW 0 36 76 Left 2
WINDOW 3 36 40 Left 2
SYMATTR InstName R23
SYMATTR Value 3.3
SYMBOL res -160 304 R180
WINDOW 0 36 76 Left 2
WINDOW 3 36 40 Left 2
SYMATTR InstName R24
SYMATTR Value 3.3
SYMBOL diode -1184 208 R0
WINDOW 0 34 14 Left 2
WINDOW 3 38 42 Left 2
SYMATTR InstName D1
SYMATTR Value MUR160
SYMBOL diode -976 208 R0
WINDOW 0 34 14 Left 2
WINDOW 3 38 42 Left 2
SYMATTR InstName D8
SYMATTR Value MUR160
SYMBOL diode -768 208 R0
WINDOW 0 34 14 Left 2
WINDOW 3 38 42 Left 2
SYMATTR InstName D9
SYMATTR Value MUR160
SYMBOL diode -560 208 R0
WINDOW 0 34 14 Left 2
WINDOW 3 38 42 Left 2
SYMATTR InstName D10
SYMATTR Value MUR160
SYMBOL diode -368 208 R0
WINDOW 0 34 14 Left 2
WINDOW 3 38 42 Left 2
SYMATTR InstName D11
SYMATTR Value MUR160
SYMBOL diode -160 208 R0
WINDOW 0 34 14 Left 2
WINDOW 3 38 42 Left 2
SYMATTR InstName D12
SYMATTR Value MUR160
TEXT 1096 -128 Left 2 !*\n.PARAM Fline=50\n.param Vgrms=230\n.PARAM Vgpeak={Vgrms*sqrt(2)}\n.PARAM Vamp={Vgpeak*2}\n.PARAM L=100u\n*
TEXT 1096 -264 Left 2 !.tran 0 150m 100m uic
TEXT 1712 -760 Left 2 !.param GfcV=20 ; magnitude at crossover *\n.param PSV=-90 ; phase lag at crossover *\n*\n* Enter Design Goals Information Here *\n*\n.param fcV=20 ; targeted crossover *\n.param PMV=60 ; choose phase margin at crossover *\n*\n* Enter the Values for Vout and Bridge Bias Current *\n*\n.param Vout=800\n.param Pout=60k ; nominal is 5 kW\n.param RL={(Vout)**2/(Pout)}\n.param Ibias=100u\n.param Vref=2.5\n.param Rlower={Vref/Ibias}\n.param Rupper={(Vout-Vref)/Ibias}\n*\n* Do not edit the below lines *\n.param boostV={PMV-PSV-90}\n.param GV={10**(-GfcV/20)}\n.param kV={tan((boostV/2+45)*pi/180)}\n.param fpV={fcV*kV}\n.param fzV={fcV/kV}\n.param C2V={1/(2*pi*fcV*GV*kV*Rupper)}\n.param C1V={C2V*(kV**2-1)}\n.param R2V={kV/(C1V*2*pi*fcV)}\n*
TEXT 2328 -760 Left 2 !* Components for the d loop *\n.param Gfcd=1.6 ; magnitude at crossover *\n.param PSd=-92 ; phase lag at crossover *\n*\n* Enter Design Goals Information Here *\n*\n.param fcd=2k ; targeted crossover *\n.param PMd=60 ; choose phase margin at crossover *\n*\n* Enter the Values for Vout and Bridge Bias Current *\n*\n.param Rdd=100k\n*\n* Do not edit the below lines *\n.param boostd={PMd-PSd-90}\n.param Gd={10**(-Gfcd/20)}\n.param kd={tan((boostd/2+45)*pi/180)}\n.param fpd={fcd*kd}\n.param fzd={fcd/kd}\n.param C2d={1/(2*pi*fcd*Gd*kd*Rdd)}\n.param C1d={C2d*(kd**2-1)}\n.param R2d={kd/(C1d*2*pi*fcd)}\n*
TEXT 2328 -104 Left 2 !* Components for the q loop *\n.param Gfcq=1.6 ; magnitude at crossover *\n.param PSq=-93 ; phase lag at crossover *\n*\n* Enter Design Goals Information Here *\n*\n.param fcq=2k ; targeted crossover *\n.param PMq=60 ; choose phase margin at crossover *\n*\n.param Rdq=100k\n*\n* Do not edit the below lines *\n.param boostq={PMq-PSq-90}\n.param Gq={10**(-Gfcq/20)}\n.param kq={tan((boostq/2+45)*pi/180)}\n.param fpq={fcq*kq}\n.param fzq={fcq/kq}\n.param C2q={1/(2*pi*fcq*Gq*kq*Rdq)}\n.param C1q={C2d*(kq**2-1)}\n.param R2q={kq/(C1q*2*pi*fcq)}\n*
TEXT 1096 56 Left 2 !.four 50 10 -1 I(Via)\n.four 50 10 -1 I(Vib)\n.four 50 10 -1 I(Vic)
TEXT 1096 -160 Left 2 !.LIB IFX_CoolSiC_Gen1_Industrial_750V.lib
TEXT 1712 16 Left 2 !.model MUR160 D(IS=7.4f RS=50m CJO=17p \n+M=0.50 vj=0.75 ISR=940p\n+BV=600 ibv=100u tt=120n)
TEXT 1096 -232 Left 2 !.options abstol=1u vntol=1m reltol=0.01\n+gmin=100p method=gear

inverse_dq0.asc, the sub-circuit schematic file:
Version 4
SHEET 1 1804 980
WIRE -464 16 -512 16
WIRE -320 16 -368 16
WIRE -192 16 -240 16
WIRE -80 16 -128 16
WIRE 192 16 32 16
WIRE 640 16 496 16
WIRE 1200 16 1072 16
WIRE -512 48 -512 16
WIRE -368 48 -368 16
WIRE -240 48 -240 16
WIRE -128 48 -128 16
WIRE 32 48 32 16
WIRE 640 48 640 16
WIRE 1200 48 1200 16
WIRE -512 160 -512 128
WIRE -368 160 -368 128
WIRE -368 160 -512 160
WIRE -240 160 -240 128
WIRE -240 160 -368 160
WIRE -128 160 -128 128
WIRE -128 160 -240 160
WIRE 32 160 32 128
WIRE 32 160 -128 160
WIRE 640 160 640 128
WIRE 640 160 32 160
WIRE 1200 160 1200 128
WIRE 1200 160 640 160
WIRE -240 176 -240 160
WIRE -400 336 -512 336
WIRE -256 336 -320 336
WIRE -208 336 -256 336
WIRE 368 336 256 336
WIRE 512 336 448 336
WIRE 560 336 512 336
WIRE 1152 336 1056 336
WIRE 1312 336 1232 336
WIRE 1360 336 1312 336
WIRE -256 352 -256 336
WIRE 512 352 512 336
WIRE 1312 352 1312 336
WIRE -512 400 -512 336
WIRE 256 400 256 336
WIRE 1056 400 1056 336
WIRE -512 544 -512 480
WIRE 256 544 256 480
WIRE 1056 544 1056 480
FLAG -240 176 0
FLAG -320 16 d
IOPIN -320 16 In
FLAG -192 16 q
IOPIN -192 16 In
FLAG -80 16 zero
IOPIN -80 16 In
FLAG 192 16 IaC
FLAG 496 16 IbC
FLAG 1072 16 IcC
FLAG -464 16 theta
IOPIN -464 16 In
FLAG -208 336 Ia
IOPIN -208 336 Out
FLAG -512 544 0
FLAG 560 336 Ib
IOPIN 560 336 Out
FLAG 256 544 0
FLAG 1360 336 Ic
IOPIN 1360 336 Out
FLAG 1056 544 0
FLAG -256 416 0
FLAG 1312 416 0
FLAG 512 416 0
SYMBOL res -384 32 R0
SYMATTR InstName R1
SYMATTR Value 1Meg
SYMBOL res -256 32 R0
SYMATTR InstName R2
SYMATTR Value 1Meg
SYMBOL res -144 32 R0
SYMATTR InstName R3
SYMATTR Value 1Meg
SYMBOL bv 32 32 R0
WINDOW 0 44 55 Left 2
WINDOW 3 -9 154 Left 2
SYMATTR InstName B1
SYMATTR Value V=((sin(V(theta))*V(d))+(cos(V(theta))*V(q))+(V(zero)/sqrt(2)))*sqrt(2/3)
SYMBOL bv 640 32 R0
WINDOW 0 46 56 Left 2
WINDOW 3 -292 183 Left 2
SYMATTR InstName B2
SYMATTR Value V=((sin(V(theta)-2*pi/3)*V(d))+(cos(V(theta)-2*pi/3)*V(q))+(V(zero)/sqrt(2)))*sqrt(2/3)
SYMBOL res -528 32 R0
SYMATTR InstName R4
SYMATTR Value 1Meg
SYMBOL bv 1200 32 R0
WINDOW 0 46 56 Left 2
WINDOW 3 -661 212 Left 2
SYMATTR InstName B3
SYMATTR Value V=((sin(V(theta)+2*pi/3)*V(d))+(cos(V(theta)+2*pi/3)*V(q))+(V(zero)/sqrt(2)))*sqrt(2/3)
SYMBOL bv -512 384 R0
WINDOW 0 44 55 Left 2
WINDOW 3 43 84 Left 2
SYMATTR InstName B4
SYMATTR Value V=IF(V(IaC)>{CLP},{CLP},IF(V(Iac)<{CLN},{CLN},V(IaC)))
SYMBOL bv 256 384 R0
WINDOW 0 44 55 Left 2
WINDOW 3 43 84 Left 2
SYMATTR InstName B5
SYMATTR Value V=IF(V(IbC)>{CLP},{CLP},IF(V(Ibc)<{CLN},{CLN},V(IbC)))
SYMBOL bv 1056 384 R0
WINDOW 0 44 55 Left 2
WINDOW 3 43 84 Left 2
SYMATTR InstName B6
SYMATTR Value V=IF(V(IcC)>{CLP},{CLP},IF(V(IcC)<{CLN},{CLN},V(IcC)))
SYMBOL res -304 320 R90
WINDOW 0 0 56 VBottom 2
WINDOW 3 32 56 VTop 2
SYMATTR InstName R5
SYMATTR Value 1k
SYMBOL res 1248 320 R90
WINDOW 0 0 56 VBottom 2
WINDOW 3 32 56 VTop 2
SYMATTR InstName R6
SYMATTR Value 1k
SYMBOL res 464 320 R90
WINDOW 0 0 56 VBottom 2
WINDOW 3 32 56 VTop 2
SYMATTR InstName R7
SYMATTR Value 1k
SYMBOL cap -272 352 R0
WINDOW 0 44 17 Left 2
WINDOW 3 45 44 Left 2
SYMATTR InstName C1
SYMATTR Value 10p
SYMBOL cap 1296 352 R0
WINDOW 0 38 20 Left 2
WINDOW 3 40 46 Left 2
SYMATTR InstName C2
SYMATTR Value 10p
SYMBOL cap 496 352 R0
WINDOW 0 37 20 Left 2
WINDOW 3 36 45 Left 2
SYMATTR InstName C3
SYMATTR Value 10p

dt_driver.asc, the sub-circuit schematic file:
Version 4
SHEET 1 880 680
WIRE 480 32 160 32
WIRE 592 32 544 32
WIRE 688 32 672 32
WIRE 720 32 688 32
WIRE 480 64 384 64
WIRE 688 64 688 32
WIRE 160 80 160 32
WIRE 240 80 160 80
WIRE 384 80 384 64
WIRE 384 80 320 80
WIRE 384 112 384 80
WIRE 240 160 240 80
WIRE 256 160 240 160
WIRE 320 160 320 80
WIRE 688 160 688 128
WIRE 160 192 160 80
WIRE 96 208 -16 208
WIRE 384 208 384 176
WIRE 160 272 160 224
WIRE 496 272 160 272
WIRE 592 272 560 272
WIRE 688 272 672 272
WIRE 720 272 688 272
WIRE 160 304 160 272
WIRE 240 304 160 304
WIRE 384 304 320 304
WIRE 496 304 384 304
WIRE 688 304 688 272
WIRE 384 336 384 304
WIRE 240 384 240 304
WIRE 256 384 240 384
WIRE 320 384 320 304
WIRE 688 400 688 368
WIRE 384 432 384 400
FLAG 384 208 0
FLAG 384 432 0
FLAG 720 32 OutN
IOPIN 720 32 Out
FLAG 720 272 OutP
IOPIN 720 272 Out
FLAG -16 208 IN
IOPIN -16 208 In
FLAG 688 160 0
FLAG 688 400 0
SYMBOL Digital\\buf 96 144 R0
SYMATTR InstName A1
SYMATTR SpiceLine Vhigh=5 Vlow=0 Ref=1.0
SYMBOL res 336 64 R90
WINDOW 0 0 56 VBottom 2
WINDOW 3 32 56 VTop 2
SYMATTR InstName R1
SYMATTR Value 1k
SYMBOL cap 368 112 R0
SYMATTR InstName C1
SYMATTR Value {CDT}
SYMBOL res 336 288 R90
WINDOW 0 0 56 VBottom 2
WINDOW 3 32 56 VTop 2
SYMATTR InstName R2
SYMATTR Value 1k
SYMBOL cap 368 336 R0
SYMATTR InstName C2
SYMATTR Value {CDT}
SYMBOL Digital\\and 512 -16 R0
SYMATTR InstName A2
SYMATTR SpiceLine Vhigh=5 Vlow=0 Ref=2.5
SYMBOL Digital\\and 528 224 R0
SYMATTR InstName A3
SYMATTR SpiceLine Vhigh=5 Vlow=0 Ref=2.5
SYMBOL diode 320 144 R90
WINDOW 0 0 32 VBottom 2
WINDOW 3 32 32 VTop 2
SYMATTR InstName D1
SYMATTR Value 1N4148
SYMBOL diode 320 368 R90
WINDOW 0 0 32 VBottom 2
WINDOW 3 32 32 VTop 2
SYMATTR InstName D2
SYMBOL res 688 16 R90
WINDOW 0 0 56 VBottom 2
WINDOW 3 32 56 VTop 2
SYMATTR InstName R3
SYMATTR Value 10
SYMBOL res 688 256 R90
WINDOW 0 0 56 VBottom 2
WINDOW 3 32 56 VTop 2
SYMATTR InstName R4
SYMATTR Value 10
SYMBOL cap 672 64 R0
SYMATTR InstName C3
SYMATTR Value 10p
SYMBOL cap 672 304 R0
SYMATTR InstName C4
SYMATTR Value 10p
TEXT 144 -48 Left 2 !.param CDT={DT/(0.691*1k)}

comptof.asc, the sub-circuit schematic file:
Version 4
SHEET 1 880 680
WIRE 64 192 -16 192
WIRE 224 192 144 192
WIRE -304 336 -368 336
WIRE -128 336 -176 336
WIRE 32 336 -48 336
WIRE -304 368 -304 336
WIRE 32 368 32 336
WIRE -176 384 -176 336
WIRE -304 496 -304 448
WIRE -176 496 -176 448
WIRE -176 496 -304 496
WIRE 32 496 32 448
WIRE 32 496 -176 496
WIRE 32 528 32 496
FLAG -16 192 NINV
IOPIN -16 192 In
FLAG 224 192 HYS
FLAG 32 528 0
FLAG -176 336 OUT
IOPIN -176 336 Out
FLAG -368 336 INV
IOPIN -368 336 In
SYMBOL bv 160 192 R90
WINDOW 0 -32 56 VBottom 2
WINDOW 3 32 56 VTop 2
SYMATTR InstName B1
SYMATTR Value V=IF(V(out) > ({VHIGH}+{VLOW})/2,{VHYS},0)
SYMBOL bv 32 352 R0
WINDOW 0 40 40 Left 2
WINDOW 3 42 70 Left 2
SYMATTR InstName B2
SYMATTR Value V=IF(V(HYS,INV)>0,{VHIGH},{VLOW})
SYMBOL res -32 320 R90
WINDOW 0 0 56 VBottom 2
WINDOW 3 32 56 VTop 2
SYMATTR InstName R1
SYMATTR Value 10
SYMBOL cap -192 384 R0
SYMATTR InstName C1
SYMATTR Value 10p
SYMBOL res -320 352 R0
SYMATTR InstName R2
SYMATTR Value 1Meg

The netlist it stands for:
* 3-phase PFC with SiC - interleaved.asc
Va N014 N SINE(0 {Vgpeak} {FLINE})
Vb N015 N SINE(0 {Vgpeak} {FLINE} 0 0 120)
Vc N016 N SINE(0 {Vgpeak} {FLINE} 0 0 240)
R1 N 0 1G
rla N009 a 10m
rlb N012 b 10m
rlc N013 c 10m
H1 ia 0 VIa 20m
H2 ib 0 VIb 20m
H3 ic 0 VIc 20m
La1 N004 N009 {L}
Lb1 N005 N012 {L}
Lc1 N013 N006 {L}
VIa N014 a 0
VIb N015 b 0
VIc N016 c 0
C1 Vout N007 820µ IC=790
R2 N007 0 2m
R4 Vout FB {Rupper}
R5 FB 0 {Rlower}
E1 va 0 a N 1
E2 vb 0 b N 1
E3 vc 0 c N 1
XX1 va vb vc theta theta_sub  ; pins Va Vb Vc theta
XX2 ia ib ic theta N051 N049 N052 dq0_sub  ; pins Ia Ib Ic theta I0 Id Iq
R6 N041 N042 {R2V}
C2 N042 FB {C1V}
C3 N041 FB {C2V}
V3 N043 0 {Vref}
R7 N047 N050 {R2d}
C4 N050 N046 {C1d}
C6 N047 N046 {C2d}
R8 0 N051 1Meg
R9 N047 N049 {Rdd}
R10 N053 N054 {R2q}
C5 N054 N048 {C1q}
C7 N053 N048 {C2q}
R11 N053 N052 {Rdq}
XX3 N046 N048 theta 0 iad iab iac inverse_dq0 params: CLP=2.9 CLN=-2.9
V4 N044 0 PULSE(-3 3 0 16.6u 16.6u 1p 33.33u)
XX4 da1 N035 N036 dt_driver params: DT=300n
XX5 db1 N037 N038 dt_driver params: DT=300n
XX6 dc1 N039 N040 dt_driver params: DT=300n
R12 theta 0 1Meg
XX7 N044 iad da1 comptof params: VHIGH=5 VLOW=100m VHYS=10m
XX8 N044 iab db1 comptof params: VHIGH=5 VLOW=100m VHYS=10m
XX9 N044 iac dc1 comptof params: VHIGH=5 VLOW=100m VHYS=10m
XX10 FB N043 N041 opampTOF params: VHIGH=5 VLOW=100m  ; pins - + OUT
XX11 N047 N041 N046 opampTOF params: VHIGH=5 VLOW=-5  ; pins - + OUT
XX12 N053 0 N048 opampTOF params: VHIGH=5 VLOW=-5  ; pins - + OUT
R13 Vout 0 {RL}
E4 N023 0 N035 0 3.6
E5 N024 SapG1 N036 0 3.6
R3 N023 San1 3.3
R14 N024 Sap1 3.3
E6 N025 0 N037 0 3.6
E7 N026 SbpG1 N038 0 3.6
R15 N025 Sbn1 3.3
R16 N026 Sbp1 3.3
E8 N027 0 N039 0 3.6
E9 N028 ScpG1 N040 0 3.6
R17 N027 Scn1 3.3
R18 N028 Scp1 3.3
XU7 Vout Sap1 SapG1 N004 IMZA75R008M1H_L0  ; pins D G S1 S2
XU8 N004 San1 0 0 IMZA75R008M1H_L0  ; pins D G S1 S2
XU9 Vout Sbp1 SbpG1 N005 IMZA75R008M1H_L0  ; pins D G S1 S2
XU10 N005 Sbn1 0 0 IMZA75R008M1H_L0  ; pins D G S1 S2
XU11 Vout Scp1 ScpG1 N006 IMZA75R008M1H_L0  ; pins D G S1 S2
XU12 N006 Scn1 0 0 IMZA75R008M1H_L0  ; pins D G S1 S2
D2 San1 N023 MUR160
D3 Sap1 N024 MUR160
D4 Sbn1 N025 MUR160
D5 Sbp1 N026 MUR160
D6 Scn1 N027 MUR160
D7 Scp1 N028 MUR160
V1 N045 0 PULSE(-3 3 16.6u 16.6u 16.6u 1p 33.33u)
XX13 N045 iad da2 comptof params: VHIGH=5 VLOW=100m VHYS=10m
XX14 N045 iab db2 comptof params: VHIGH=5 VLOW=100m VHYS=10m
XX15 N045 iac dc2 comptof params: VHIGH=5 VLOW=100m VHYS=10m
XU1 Vout Sap2 SapG2 N001 IMZA75R008M1H_L0  ; pins D G S1 S2
XU2 N001 San2 0 0 IMZA75R008M1H_L0  ; pins D G S1 S2
XU3 Vout Sbp2 SbpG2 N002 IMZA75R008M1H_L0  ; pins D G S1 S2
XU4 N002 Sbn2 0 0 IMZA75R008M1H_L0  ; pins D G S1 S2
XU5 Vout Scp2 ScpG2 N003 IMZA75R008M1H_L0  ; pins D G S1 S2
XU6 N003 Scn2 0 0 IMZA75R008M1H_L0  ; pins D G S1 S2
rla1 N008 a 10m
rlb1 N010 b 10m
rlc1 N011 c 10m
La2 N001 N008 {L}
Lb2 N002 N010 {L}
Lc2 N011 N003 {L}
XX16 da2 N029 N030 dt_driver params: DT=300n
XX17 db2 N031 N032 dt_driver params: DT=300n
XX18 dc2 N033 N034 dt_driver params: DT=300n
E10 N017 0 N029 0 3.6
E11 N018 SapG2 N030 0 3.6
R19 N017 San2 3.3
R20 N018 Sap2 3.3
E12 N019 0 N031 0 3.6
E13 N020 SbpG2 N032 0 3.6
R21 N019 Sbn2 3.3
R22 N020 Sbp2 3.3
E14 N021 0 N033 0 3.6
E15 N022 ScpG2 N034 0 3.6
R23 N021 Scn2 3.3
R24 N022 Scp2 3.3
D1 San2 N017 MUR160
D8 Sap2 N018 MUR160
D9 Sbn2 N019 MUR160
D10 Sbp2 N020 MUR160
D11 Scn2 N021 MUR160
D12 Scp2 N022 MUR160

* block symbol definitions
.subckt inverse_dq0 d q theta zero Ia Ib Ic
R1 d 0 1Meg
R2 q 0 1Meg
R3 zero 0 1Meg
B1 IaC 0 V=((sin(V(theta))*V(d))+(cos(V(theta))*V(q))+(V(zero)/sqrt(2)))*sqrt(2/3)
B2 IbC 0 V=((sin(V(theta)-2*pi/3)*V(d))+(cos(V(theta)-2*pi/3)*V(q))+(V(zero)/sqrt(2)))*sqrt(2/3)
R4 theta 0 1Meg
B3 IcC 0 V=((sin(V(theta)+2*pi/3)*V(d))+(cos(V(theta)+2*pi/3)*V(q))+(V(zero)/sqrt(2)))*sqrt(2/3)
B4 N001 0 V=IF(V(IaC)>{CLP},{CLP},IF(V(Iac)<{CLN},{CLN},V(IaC)))
B5 N002 0 V=IF(V(IbC)>{CLP},{CLP},IF(V(Ibc)<{CLN},{CLN},V(IbC)))
B6 N003 0 V=IF(V(IcC)>{CLP},{CLP},IF(V(IcC)<{CLN},{CLN},V(IcC)))
R5 Ia N001 1k
R6 Ic N003 1k
R7 Ib N002 1k
C1 Ia 0 10p
C2 Ic 0 10p
C3 Ib 0 10p
.ends inverse_dq0

.subckt dt_driver IN OutN OutP
A1 IN 0 0 0 0 N004 N001 0 BUF Vhigh=5 Vlow=0 Ref=1.0
R1 N003 N001 1k
C1 N003 0 {CDT}
R2 N006 N004 1k
C2 N006 0 {CDT}
A2 0 N001 0 N003 0 0 N002 0 AND Vhigh=5 Vlow=0 Ref=2.5
A3 0 N004 0 N006 0 0 N005 0 AND Vhigh=5 Vlow=0 Ref=2.5
D1 N003 N001 1N4148
D2 N006 N004 D
R3 OutN N002 10
R4 OutP N005 10
C3 OutN 0 10p
C4 OutP 0 10p
.param CDT={DT/(0.691*1k)}
.ends dt_driver

.subckt comptof INV NINV OUT
B1 HYS NINV V=IF(V(out) > ({VHIGH}+{VLOW})/2,{VHYS},0)
B2 N001 0 V=IF(V(HYS,INV)>0,{VHIGH},{VLOW})
R1 N001 OUT 10
C1 OUT 0 10p
R2 INV 0 1Meg
.ends comptof

.model D D
.lib standard.dio
*
.PARAM Fline=50
.param Vgrms=230
.PARAM Vgpeak={Vgrms*sqrt(2)}
.PARAM Vamp={Vgpeak*2}
.PARAM L=100u
*
.tran 0 150m 100m uic
.param GfcV=20 ; magnitude at crossover *
.param PSV=-90 ; phase lag at crossover *
*
* Enter Design Goals Information Here *
*
.param fcV=20 ; targeted crossover *
.param PMV=60 ; choose phase margin at crossover *
*
* Enter the Values for Vout and Bridge Bias Current *
*
.param Vout=800
.param Pout=60k ; nominal is 5 kW
.param RL={(Vout)**2/(Pout)}
.param Ibias=100u
.param Vref=2.5
.param Rlower={Vref/Ibias}
.param Rupper={(Vout-Vref)/Ibias}
*
* Do not edit the below lines *
.param boostV={PMV-PSV-90}
.param GV={10**(-GfcV/20)}
.param kV={tan((boostV/2+45)*pi/180)}
.param fpV={fcV*kV}
.param fzV={fcV/kV}
.param C2V={1/(2*pi*fcV*GV*kV*Rupper)}
.param C1V={C2V*(kV**2-1)}
.param R2V={kV/(C1V*2*pi*fcV)}
*
* Components for the d loop *
.param Gfcd=1.6 ; magnitude at crossover *
.param PSd=-92 ; phase lag at crossover *
*
* Enter Design Goals Information Here *
*
.param fcd=2k ; targeted crossover *
.param PMd=60 ; choose phase margin at crossover *
*
* Enter the Values for Vout and Bridge Bias Current *
*
.param Rdd=100k
*
* Do not edit the below lines *
.param boostd={PMd-PSd-90}
.param Gd={10**(-Gfcd/20)}
.param kd={tan((boostd/2+45)*pi/180)}
.param fpd={fcd*kd}
.param fzd={fcd/kd}
.param C2d={1/(2*pi*fcd*Gd*kd*Rdd)}
.param C1d={C2d*(kd**2-1)}
.param R2d={kd/(C1d*2*pi*fcd)}
*
* Components for the q loop *
.param Gfcq=1.6 ; magnitude at crossover *
.param PSq=-93 ; phase lag at crossover *
*
* Enter Design Goals Information Here *
*
.param fcq=2k ; targeted crossover *
.param PMq=60 ; choose phase margin at crossover *
*
.param Rdq=100k
*
* Do not edit the below lines *
.param boostq={PMq-PSq-90}
.param Gq={10**(-Gfcq/20)}
.param kq={tan((boostq/2+45)*pi/180)}
.param fpq={fcq*kq}
.param fzq={fcq/kq}
.param C2q={1/(2*pi*fcq*Gq*kq*Rdq)}
.param C1q={C2d*(kq**2-1)}
.param R2q={kq/(C1q*2*pi*fcq)}
*
.four 50 10 -1 I(Via)
.four 50 10 -1 I(Vib)
.four 50 10 -1 I(Vic)
.LIB IFX_CoolSiC_Gen1_Industrial_750V.lib
.model MUR160 D(IS=7.4f RS=50m CJO=17p
+M=0.50 vj=0.75 ISR=940p
+BV=600 ibv=100u tt=120n)
.options abstol=1u vntol=1m reltol=0.01
+gmin=100p method=gear
.backanno
.end